# Altium schematic sheet MAIN.SchDoc
size Tabloid; Author: Lihong; Chenwei; CompanyName: Penn Electric Racing; DrawnBy: Lihong; Chenwei; Engineer: Lihong; Chenwei; Organization: Penn Electric Racing; Address1: 220 S. 33rd St; Address2: Towne Bldg, B11; Address3: Philadelpia, PA 19104; Address4: USA; SheetNumber: 1; SheetTotal: 8
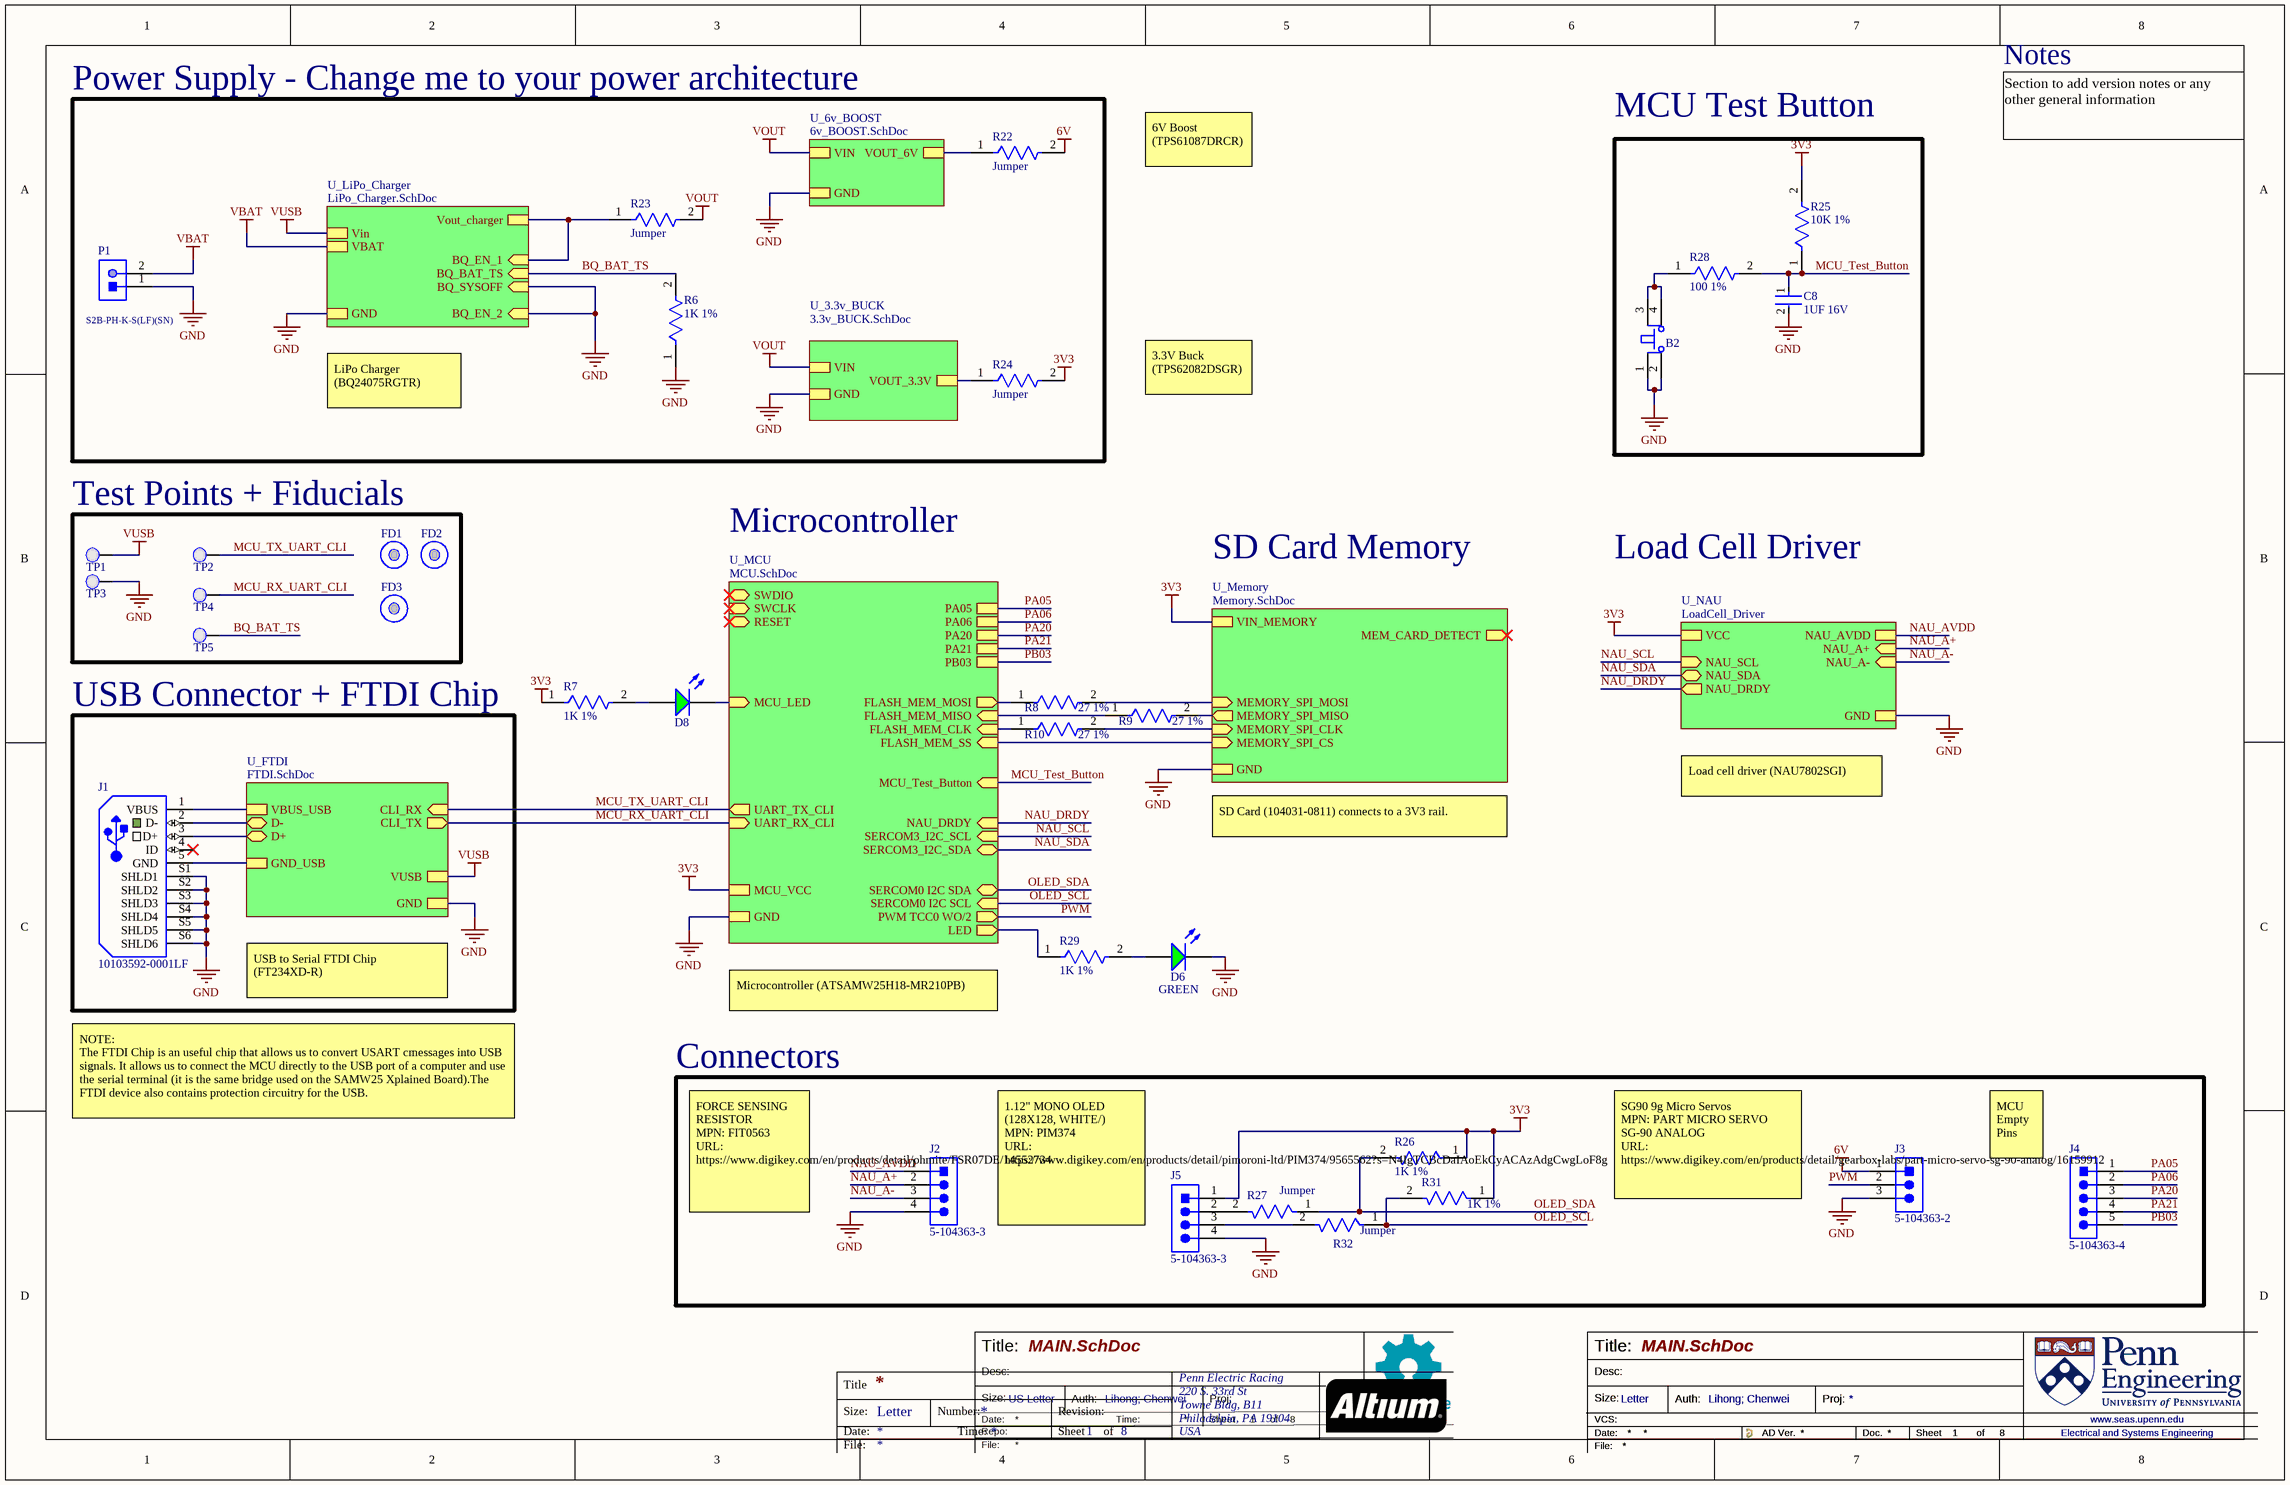
[diagram p0: MAIN.SchDoc]

## Parts
B2  PTS810SJK250SMTRLFS  [PTS810SJK250SMTRLFS-Footprint-1]  (value not drawn)
C8  1UF 16V  [FP-CC0603-DA-MFG]
D6  GREEN  [LED_0805]
D8  LSM0805452V  [LED_0805]  (value not drawn)
FD1  Fiducial 40x100mm  [Fiducial 40x100mm-Footprint-1]  (value not drawn)
FD2  Fiducial 40x100mm  [Fiducial 40x100mm-Footprint-1]  (value not drawn)
FD3  Fiducial 40x100mm  [Fiducial 40x100mm-Footprint-1]  (value not drawn)
J1  10103592-0001LF  [10103592-0001LF-Footprint-1]
J2  5-104363-3  [5-104363-3-Footprint-1]
J3  5-104363-2  [5-104363-2-Footprint-1]
J4  5-104363-4  [5-104363-4-Footprint-1]
J5  5-104363-3  [5-104363-3-Footprint-1]
P1  S2B-PH-K-S(LF)(SN)  [JST-S2B-PH-K-S_V]
R6  1K 1%  [FP-RNCP0603-IPC_C]
R7  1K 1%  [FP-RNCP0603-IPC_C]
R8  27 1%  [FP-RMCF0603-IPC_B]
R9  27 1%  [FP-RMCF0603-IPC_B]
R10  27 1%  [FP-RMCF0603-IPC_B]
R22  Jumper  [FP-RMCF0603-MFG]
R23  Jumper  [FP-RMCF0603-MFG]
R24  Jumper  [FP-RMCF0603-MFG]
R25  10K 1%  [FP-RNCP0603-IPC_A]
R26  1K 1%  [FP-RNCP0603-IPC_C]
R27  Jumper  [FP-RMCF0603-MFG]
R28  100 1%  [FP-RMCF0603-IPC_C]
R29  1K 1%  [FP-RNCP0603-IPC_C]
R31  1K 1%  [FP-RNCP0603-IPC_C]
R32  Jumper  [FP-RMCF0603-MFG]
TP1  Test Point 0.1"  [Test Point 0.1"-Footprint-1]  (value not drawn)  (no BOM)
TP2  Test Point 0.1"  [Test Point 0.1"-Footprint-1]  (value not drawn)
TP3  Test Point 0.1"  [Test Point 0.1"-Footprint-1]  (value not drawn)
TP4  Test Point 0.1"  [Test Point 0.1"-Footprint-1]  (value not drawn)
TP5  Test Point 0.1"  [Test Point 0.1"-Footprint-1]  (value not drawn)

## Blocks framed on the sheet
Power Supply - Change me to your power architecture: P1 R6 R22-R24
MCU Test Button: B2 C8 R25 R28
Test Points + Fiducials: FD1-FD3 TP1-TP5
USB Connector + FTDI Chip: J1
Connectors: J2-J5 R26 R27 R31 R32

## Sub-sheets
U_3.3v_BUCK = 3.3v_BUCK.SchDoc: VIN, GND, VOUT_3.3V
U_6v_BOOST = 6v_BOOST.SchDoc: VIN, VOUT_6V, GND
U_FTDI = FTDI.SchDoc: CLI_RX (in), CLI_TX (out), VUSB, GND, VBUS_USB, D- (bidir), D+ (bidir), GND_USB
U_LiPo_Charger = LiPo_Charger.SchDoc: BQ_EN_2 (in), BQ_SYSOFF (in), BQ_EN_1 (in), BQ_BAT_TS (in), Vin, GND, VBAT, Vout_charger
U_MCU = MCU.SchDoc: SWDIO (bidir), SWCLK (in), UART_TX_CLI (out), UART_RX_CLI (in), FLASH_MEM_SS (in), FLASH_MEM_CLK (in), FLASH_MEM_MISO (in), FLASH_MEM_MOSI (out), RESET (bidir), MCU_LED (in), MCU_VCC, GND, SERCOM0 I2C SDA (bidir), SERCOM0 I2C SCL (in), PWM TCC0 WO/2 (out), LED (out), PA05, PA06, PA20, PA21, PB03, MCU_Test_Button (in), NAU_DRDY (in), SERCOM3_I2C_SCL (in), SERCOM3_I2C_SDA (bidir)
U_Memory = Memory.SchDoc: MEMORY_SPI_MOSI (in), MEMORY_SPI_MISO (out), MEMORY_SPI_CLK (in), MEMORY_SPI_CS (in), MEM_CARD_DETECT (out), VIN_MEMORY, GND
U_NAU = LoadCell_Driver: VCC, GND, NAU_AVDD, NAU_SCL (in), NAU_SDA (bidir), NAU_DRDY (out), NAU_A- (in), NAU_A+ (in)

## Nets
3V3: J5.1 R7.1 R24.2 R25.2 R26.1 R31.1 ; sheet U_MCU/MCU_VCC, sheet U_Memory/VIN_MEMORY, sheet U_NAU/VCC
6V: J3.1 R22.2
GND: B2.1 B2.2 C8.2 D6.K J1.S1(SHLD1) J1.S2(SHLD2) J1.S3(SHLD3) J1.S4(SHLD4) J1.S5(SHLD5) J1.S6(SHLD6) J2.4 J3.3 J5.4 P1.1 R6.1 TP3.1(PAD) ; sheet U_FTDI/GND, sheet U_MCU/GND, sheet U_Memory/GND, sheet U_LiPo_Charger/BQ_EN_2, sheet U_LiPo_Charger/BQ_SYSOFF, sheet U_LiPo_Charger/GND, sheet U_6v_BOOST/GND, sheet U_3.3v_BUCK/GND, sheet U_NAU/GND
VBAT: P1.2 ; sheet U_LiPo_Charger/VBAT
VOUT: R23.2 ; sheet U_6v_BOOST/VIN, sheet U_3.3v_BUCK/VIN
VUSB: TP1.1(PAD) ; sheet U_FTDI/VUSB, sheet U_LiPo_Charger/Vin
BQ_BAT_TS: R6.2 TP5.1(PAD) ; sheet U_LiPo_Charger/BQ_BAT_TS
MCU_RX_UART_CLI: TP4.1(PAD) ; sheet U_FTDI/CLI_TX, sheet U_MCU/UART_RX_CLI
MCU_Test_Button: C8.1 R25.1 R28.2 ; sheet U_MCU/MCU_Test_Button
MCU_TX_UART_CLI: TP2.1(PAD) ; sheet U_FTDI/CLI_RX, sheet U_MCU/UART_TX_CLI
NAU_A+: J2.2 ; sheet U_NAU/NAU_A+
NAU_A-: J2.3 ; sheet U_NAU/NAU_A-
NAU_AVDD: J2.1 ; sheet U_NAU/NAU_AVDD
NAU_DRDY: sheet U_MCU/NAU_DRDY, sheet U_NAU/NAU_DRDY
NAU_SCL: sheet U_MCU/SERCOM3_I2C_SCL, sheet U_NAU/NAU_SCL
NAU_SDA: sheet U_MCU/SERCOM3_I2C_SDA, sheet U_NAU/NAU_SDA
OLED_SCL: R31.2 R32.1 ; sheet U_MCU/SERCOM0 I2C SCL
OLED_SDA: R26.2 R27.1 ; sheet U_MCU/SERCOM0 I2C SDA
PA05: J4.1 ; sheet U_MCU/PA05
PA06: J4.2 ; sheet U_MCU/PA06
PA20: J4.3 ; sheet U_MCU/PA20
PA21: J4.4 ; sheet U_MCU/PA21
PB03: J4.5 ; sheet U_MCU/PB03
PWM: J3.2 ; sheet U_MCU/PWM TCC0 WO/2
NetB2_3: B2.3 B2.4 R28.1
NetD6_A: D6.A R29.2
NetD8_A: D8.A R7.2
NetD8_K: D8.K ; sheet U_MCU/MCU_LED
NetJ1_1: J1.1(VBUS) ; sheet U_FTDI/VBUS_USB
NetJ1_2: J1.2(D-) ; sheet U_FTDI/D-
NetJ1_3: J1.3(D+) ; sheet U_FTDI/D+
NetJ1_5: J1.5(GND) ; sheet U_FTDI/GND_USB
NetJ5_2: J5.2 R27.2
NetJ5_3: J5.3 R32.2
NetR8_1: R8.1 ; sheet U_MCU/FLASH_MEM_MOSI
NetR8_2: R8.2 ; sheet U_Memory/MEMORY_SPI_MOSI
NetR9_1: R9.1 ; sheet U_MCU/FLASH_MEM_MISO
NetR9_2: R9.2 ; sheet U_Memory/MEMORY_SPI_MISO
NetR10_1: R10.1 ; sheet U_MCU/FLASH_MEM_CLK
NetR10_2: R10.2 ; sheet U_Memory/MEMORY_SPI_CLK
NetR22_1: R22.1 ; sheet U_6v_BOOST/VOUT_6V
NetR23_1: R23.1 ; sheet U_LiPo_Charger/BQ_EN_1, sheet U_LiPo_Charger/Vout_charger
NetR24_1: R24.1 ; sheet U_3.3v_BUCK/VOUT_3.3V
NetR29_1: R29.1 ; sheet U_MCU/LED
(unnamed): sheet U_MCU/FLASH_MEM_SS, sheet U_Memory/MEMORY_SPI_CS

Not connected (* = marked no-connect by the designer): J1 4(ID)*

## Notes on the sheet
- Notes
- 6V Boost (TPS61087DRCR)
- Section to add version notes or any other general information
- LiPo Charger (BQ24075RGTR)
- 3.3V Buck (TPS62082DSGR)
- Microcontroller
- SD Card Memory
- Load Cell Driver
- SD Card (104031-0811) connects to a 3V3 rail.
- Load cell driver (NAU7802SGI)
- USB to Serial FTDI Chip (FT234XD-R)
- Microcontroller (ATSAMW25H18-MR210PB)
- NOTE:
  The FTDI Chip is an useful chip that allows us to convert USART cmessages into USB signals. It allows us to connect the MCU directly to the USB port of a computer and use the serial terminal (it is the same bridge used on the SAMW25 Xplained Board).The FTDI device also contains protection circuitry for the USB.
- MCU Empty Pins
- FORCE SENSING RESISTOR
  MPN: FIT0563
  URL: https://www.digikey.com/en/products/detail/ohmite/FSR07DE/14552734
- 1.12" MONO OLED (128X128, WHITE/)
  MPN: PIM374
  URL: https://www.digikey.com/en/products/detail/pimoroni-ltd/PIM374/9565562?s=N4IgTCBcDaIAoEkCyACAzAdgCwgLoF8g
- SG90 9g Micro Servos
  MPN: PART MICRO SERVO SG-90 ANALOG
  URL: https://www.digikey.com/en/products/detail/gearbox-labs/part-micro-servo-sg-90-analog/16159912
- Title:
- Desc:
- Title
- Size:
- Date:
- Letter
- Number:
- Time:
- File:
- Repo:
- US Letter
- Revision:
- Sheet
- Auth:
- of
- Proj:
- www.seas.upenn.edu
- Electrical and Systems Engineering

## Library data of the parts
B2 = CMP-00084-2: Keypad Switch, 1 Switches, SPST, Momentary-tactile, 0.05A, 16VDC, 3.23N, Solder Terminal, Surface Mount-straight; Manufacturer Series: PTS810; Actuator Length: 0.028inch; Electrical Life: 50000Cycles; Contact Resistance: 0.5mR; Solderability: REFLOW; Actuator Travel: 0.1524mm; Actuator Color: White; Actuator Type: Pushbutton; Insulation Resistance: 100MR; Dielectric Withstand Volts: 250VACV; Switch Function: OFF-MOM; Reach SVHC Compliant: Yes; Terminal Finish: Silver; Switch Type: Keypad; Switch Action: MOMENTARY; RoHS Compliant: Yes; JESD-609 Code: e4; Max Operating Temperature: 85°C; Termination: Solder; Min Operating Temperature: -40°C; Mounting Technology: Surface Mount; Circuit: SPST; Type: Tactile
C8 = CMP-03422-001047-1: CC0603 1 uF X7R 10.00% 16 V; Manufacturer: YAGEO; Manufacturer Part Number: CC0603KPX7R7BB105; Temperature Coefficient: 15%; Tolerance: 0.1; Material: Ceramic; Device Class L3: Ceramic Capacitors; Temperature Characteristic: X7R; Device Class L2: Capacitors; Temperature Range Low: -55°C; Footprint Url: http://www.yageo.com/exep/pages/download/literatures/UPY-C_GEN_24.pdf; Device Class L1: Passive Components; Temperature: -55°C to +125°C; Voltage Rating: 16 V; RoHS: TRUE; ComponentLink2URL: http://www.yageo.com/documents/recent/UPY-GPHC_X7R_6.3V-to-50V_18.pdf; Mouser Description: Cap Ceramic 1uF 16V X7R 10% SMD 0603 125°C Paper T/R; Octopart: https://octopart.com/cc0603kpx7r7bb105-yageo-25629533; Automotive: No; Capacitance: 1 uF; Height: 0.9mm; Voltage: 16 V; Lead Free: Yes; Category: Cap; Package: CC0603-DA; Temperature Range High: +125°C; Value: 1 uF; ComponentLink2Description: Datasheet
D6 D8 = CMP-00038-3: Single Color LED, Green, 0805; Test Current: 20mA; Forward Voltage: 2V; RoHS Compliant: Yes
FD1-FD3 = CMP-00085-1
J1 = CMP-00092-5: Conn Micro USB 2.0 Type B RCP 5 POS 0.65mm Solder RA SMD 5 Terminal 1 Port T/R
J2 J5 = CMP-00105-2: Board Connector, 4 Contact(s), 1 Row(s), Male, Straight, 0.1 inch Pitch, Solder Terminal, Locking, Black Insulator, Plug
J3 = CMP-00106-1: Board Connector, 3 Contact(s), 1 Row(s), Male, Straight, 0.1 inch Pitch, Solder Terminal, Latch, Black Insulator, Plug
J4 = CMP-00107-1: Board Connector, 5 Contact(s), 1 Row(s), Male, Straight, 0.1 inch Pitch, Solder Terminal, Locking, Black Insulator, Plug
P1 = CMP-1755-00004-1: Male Header, Pitch 2 mm, 1 x 2 Position, Height 4.8 mm, Tail Length 3.4 mm, -25 to 85 degC, RoHS, Bulk; Case\Package: Radial; Tolerance: 20%; Capacitance: 10 uF; Voltage Rating (DC): 50 V; Packaging: Bulk; ComponentLink1URL: http://www.jst-mfg.com/product/pdf/eng/ePH.pdf; Radiation Hardening: No; Height: 11 mm; Package Quantity: 200; PackageDescription: Male Header, Pitch 2 mm, 1 x 2 Position, Height 4.8 mm, Tail Length 3.4 mm; PackageReference: S2B-PH-K-S; Diameter: 5 mm; Pins: 2; Mount: Through Hole; Max Operating Temperature: 85 degC; Min Operating Temperature: -40 degC; ComponentLink1Description: Datasheet; DatasheetVersion: Dec-12; Length: 11 mm; Lead Pitch: 2 mm; REACH SVHC: No SVHC; Voltage Rating: 50 V; RoHSCompliant: true
R6 R7 R26 R29 R31 = CMP-26527-006179-1: 1kΩ ±1% 0.125W 0603 High Power Anti-Sulfur Thin Film Chip Resistor; Temperature Coefficient: 100ppm/°C; Max Power Dissipation: 125mW; Resistance: 1kR; Case/Package: 0603; Width: 0.031inch; Tolerance: 1%; Case Code (Imperial): 0603; RoHS Compliant: Yes; Min Operating Temperature: -55°C; Resistor Type: Thin Film; Features: Moisture Resistant; Length: 0.059inch; Mount: Surface Mount; Case Code (Metric): 1608; Height: 0.02inch; Max Operating Temperature: 155°C; Packaging: Tape and Reel; Series: RNCP; Number of Terminations: 2
R8-R10 = CMP-26527-005743-1: 27Ω ±1% 0.1W 0603 Thick Film Chip Resistor AEC-Q200 compliant; Max Power Dissipation: 100mW; Resistance: 27R; Temperature Coefficient: 100ppm/°C; Case/Package: 0603; Contact Plating: Tin; Packaging: Tape and Reel; Length: 0.061inch; Radiation Hardening: No; Mount: Surface Mount; Series: RMCF; Min Operating Temperature: -55°C; Lead Free: Lead Free; Width: 0.031inch; Resistor Type: Thick Film; Max Operating Temperature: 155°C; RoHS Compliant: Yes; Case Code (Imperial): 0603; Height: 0.022inch; Number of Terminations: 2; Case Code (Metric): 1608; Tolerance: 1%; Features: Automotive AEC-Q200
R22-R24 R27 R32 = CMP-26527-000011-1: RES 0 OHM JUMPER 1/10W 0603; Manufacturer Part Number: RMCF0603ZT0R00; Manufacturer: Stackpole; Power Rating: 0.1W; Voltage Rating: 75V; Resistance: 0mΩ; Automotive Grade: Grade 0; Value: 0mΩ; Series: RMCF; Device Class L1: Passive Components; Device Class L3: Chip SMD Resistors; Octopart: https://octopart.com/rmcf0603zt0r00-stackpole+electronics-19213618; Temperature: -55°C to +155°C; Lead Free: Yes; ComponentLink2URL: https://www.seielect.com/catalog/sei-rmcf_rmcp.pdf; Height: 0.55mm; Composition: Thick Film; Package: RMCF0603; Automotive: Yes; Temperature Range High: +155°C; Ipc Land Pattern Name: RESC15580X45; Digikey Description: RES 0 OHM JUMPER 1/10W 0603; RoHS: TRUE; ComponentLink2Description: Datasheet; Temperature Range Low: -55°C; Category: Res; Device Class L2: Resistors
R25 = CMP-26527-000099-1: 10kΩ ±1% 0.125W 0603 High Power Anti-Sulfur Thin Film Chip Resistor; Resistance: 10kR; Max Power Dissipation: 125mW; Temperature Coefficient: 100ppm/°C; Max Operating Temperature: 155°C; Width: 0.031inch; Height: 0.02inch; Lead Free: Lead Free; Contact Plating: Tin; Tolerance: 1%; Resistor Type: Thin Film; Series: RNCP; RoHS Compliant: Yes; Features: Moisture Resistant; Min Operating Temperature: -55°C; Case Code (Metric): 1608; Case/Package: 0603; Mount: Surface Mount; Packaging: Tape and Reel; Radiation Hardening: No; Length: 0.059inch; Number of Terminations: 2; Case Code (Imperial): 0603
R28 = CMP-26527-006079-1: 100Ω ±1% 0.1W 0603 Thick Film Chip Resistor AEC-Q200 compliant; Resistance: 100R; Power Rating: 100mW; Temperature Coefficient: 100ppm/°C; Radiation Hardening: No; Case Code (Metric): 1608; RoHS Compliant: Yes; Height: 0.022inch; Case/Package: 0603; Construction: Rectangular; Case Code (Imperial): 0603; Series: RMCF; Military Standard: Not; Max Operating Temperature: 155°C; Resistor Type: Thick Film; Depth: 0.8mm; Features: Automotive AEC-Q200; Width: 0.031inch; Length: 1.55mm; Size Code: 0603; Mount: Surface Mount; Contact Plating: Tin; Max Power Dissipation: 100mW; Number of Terminations: 2; Min Operating Temperature: -55°C; Packaging: Tape and Reel; Lead Free: Lead Free; Tolerance: 1%
TP1-TP5 = CMP-00086-1